# Altium project NCS_wireless_display.PrjPcb
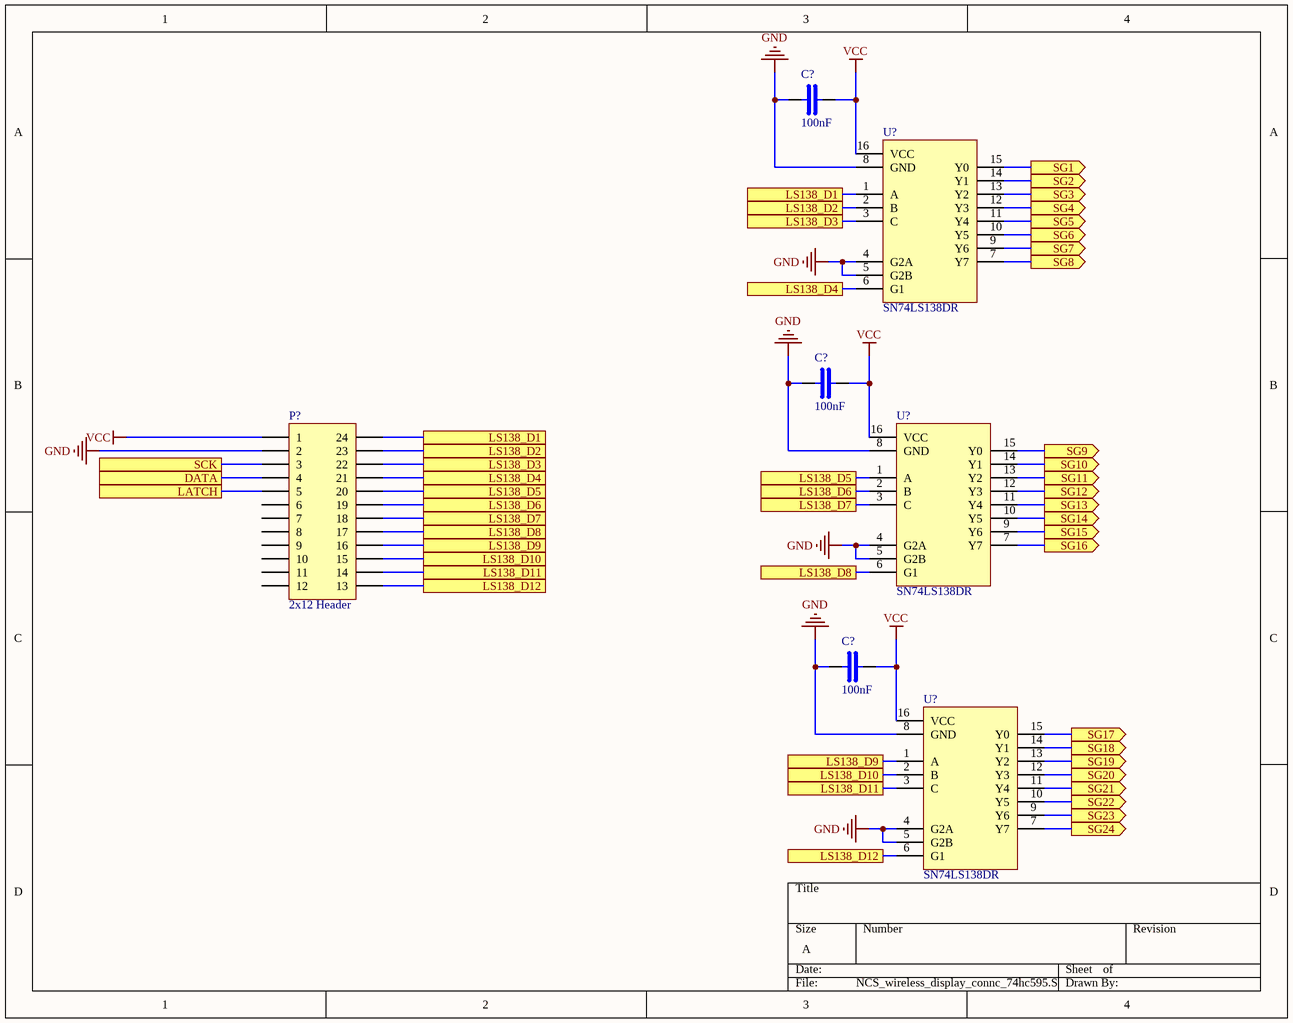
[diagram p0: NCS_wireless_display_connc_74hc595.SchDoc]
3 sheets, 18 parts. Net scope: flat (ports and power ports of the same name join across sheets).
Board file: NCS_wireless_display.PcbDoc
Sheets:
  NCS_wireless_display_connc_74hc595.SchDoc
  NCS_wireless_display_595.SchDoc
  NCS_wireless_display_raw1.SchDoc

## Sheet NCS_wireless_display_connc_74hc595.SchDoc
size A

### Parts
(Parts that share a designator on the sheet are numbered #1, #2 ... from top to bottom, then left to right.)
C?#1  100nF  [C0805C104K3RACTU_100nF]
C?#2  100nF  [C0805C104K3RACTU_100nF]
C?#3  100nF  [C0805C104K3RACTU_100nF]
P?  2x12 Header  [2x12 header]
U?#1  SN74LS138DR  [SN74LS138DR_SOIC16]
U?#2  SN74LS138DR  [SN74LS138DR_SOIC16]
U?#3  SN74LS138DR  [SN74LS138DR_SOIC16]

### Ports
DATA, LATCH, LS138_D1, LS138_D2, LS138_D3, LS138_D4, LS138_D5, LS138_D6, LS138_D7, LS138_D8, LS138_D9, LS138_D10, LS138_D11, LS138_D12, SCK, SG1 (out), SG2 (out), SG3 (out), SG4 (out), SG5 (out), SG6 (out), SG7 (out), SG8 (out), SG9 (out), SG10 (out), SG11 (out), SG12 (out), SG13 (out), SG14 (out), SG15 (out), SG16 (out), SG17 (out), SG18 (out), SG19 (out), SG20 (out), SG21 (out), SG22 (out), SG23 (out), SG24 (out)

### Nets
GND: C?#1.1 C?#2.1 C?#3.1 P?.2 U?#1.4(G2A) U?#1.5(G2B) U?#1.8(GND) U?#2.4(G2A) U?#2.5(G2B) U?#2.8(GND) U?#3.4(G2A) U?#3.5(G2B) U?#3.8(GND)
VCC: C?#1.2 C?#2.2 C?#3.2 P?.1 U?#1.16(VCC) U?#2.16(VCC) U?#3.16(VCC)
NetP?_3: P?.3 ; port SCK
NetP?_4: P?.4 ; port DATA
NetP?_5: P?.5 ; port LATCH
NetP?_13: P?.13 U?#3.6(G1) ; port LS138_D12
NetP?_14: P?.14 U?#3.3(C) ; port LS138_D11
NetP?_15: P?.15 U?#3.2(B) ; port LS138_D10
NetP?_16: P?.16 U?#3.1(A) ; port LS138_D9
NetP?_17: P?.17 U?#2.6(G1) ; port LS138_D8
NetP?_18: P?.18 U?#2.3(C) ; port LS138_D7
NetP?_19: P?.19 U?#2.2(B) ; port LS138_D6
NetP?_20: P?.20 U?#2.1(A) ; port LS138_D5
NetP?_21: P?.21 U?#1.6(G1) ; port LS138_D4
NetP?_22: P?.22 U?#1.3(C) ; port LS138_D3
NetP?_23: P?.23 U?#1.2(B) ; port LS138_D2
NetP?_24: P?.24 U?#1.1(A) ; port LS138_D1
NetR?_1: U?#1.15(Y0) ; port SG1
NetU?#1_7: U?#1.7(Y7) ; port SG8
NetU?#1_9: U?#1.9(Y6) ; port SG7
NetU?#1_10: U?#1.10(Y5) ; port SG6
NetU?#1_11: U?#1.11(Y4) ; port SG5
NetU?#1_12: U?#1.12(Y3) ; port SG4
NetU?#1_13: U?#1.13(Y2) ; port SG3
NetU?#1_14: U?#1.14(Y1) ; port SG2
NetU?#2_7: U?#2.7(Y7) ; port SG16
NetU?#2_9: U?#2.9(Y6) ; port SG15
NetU?#2_10: U?#2.10(Y5) ; port SG14
NetU?#2_11: U?#2.11(Y4) ; port SG13
NetU?#2_12: U?#2.12(Y3) ; port SG12
NetU?#2_13: U?#2.13(Y2) ; port SG11
NetU?#2_14: U?#2.14(Y1) ; port SG10
NetU?#2_15: U?#2.15(Y0) ; port SG9
NetU?#3_7: U?#3.7(Y7) ; port SG24
NetU?#3_9: U?#3.9(Y6) ; port SG23
NetU?#3_10: U?#3.10(Y5) ; port SG22
NetU?#3_11: U?#3.11(Y4) ; port SG21
NetU?#3_12: U?#3.12(Y3) ; port SG20
NetU?#3_13: U?#3.13(Y2) ; port SG19
NetU?#3_14: U?#3.14(Y1) ; port SG18
NetU?#3_15: U?#3.15(Y0) ; port SG17

Not connected (* = marked no-connect by the designer): P? 6 7 8 9 10 11 12

### Library data of the parts
C?#1-C?#3 = C0805C104K3RACTU: Multilayer Ceramic Capacitor, 0.1 uF, 25 V, ï¿½ 10%, X7R, 0805 [2012 Metric]; Manufacturer: KEMET; Material: 4241ConductorMaterial; Voltage Rating: 25V; Temperature Coefficient: 30ppm/°C; Supplier: Mouser; Supplier Part Number: 80-C0805C104K3R; Manufacturer Part Number: C0805C104K3RACTU; RoHS: Yes; Category: Ceramic Capacitors; Stock: 259681; Pricing: 1=0.1, 10=0.03, 50=0.03, 100=0.027, 1000=0.021, 10000=0.015 (USD); Mounting Technology: Surface Mount,PCB; Case/Package: 0805; Pins: 2NUMBER; Case Code (Imperial): 0805; Case Code (Metric): 2012; Min Operating Temperature: -55°C; Max Operating Temperature: 125°C; Packaging: Tape and Reel; Tolerance: 10%; Value: 100nF; Dielectric: X7R; Termination: SMD/SMT; Package Quantity: 4000; Series: SMD Comm X7R; Voltage Rating (DC): 25V; Construction: Flat; Length: 2mm; Width: 1.2mm; Height: 0.9mm; Depth: 1.25mm; Lead Pitch: 0.75mm; Thickness: 889um; Radiation Hardening: No; RoHS Compliant: Yes; Lead Free: 5697LeadFree; Reach SVHC Compliant: 4186SVHC; ComponentLink1URL: https://datasheet.ciiva.com/7842/kem-c1002-x7r-smd-7842536.pdf?src-supplier=Element14; ComponentLink1Description: https://datasheet.ciiva.com/7842/kem-c1002-x7r-smd-7842536.pdf?src-supplier=Element14; ComponentLink2URL: https://datasheet.ciiva.com/7842/kem-c1002-x7r-smd-7842538.pdf?src-supplier=Element14; ComponentLink2Description: https://datasheet.ciiva.com/7842/kem-c1002-x7r-smd-7842538.pdf?src-supplier=Element14
P? = 0702462401: 2.54mm Pitch C-Grid Header Low Profile Dual Row Vertical Shrouded 24 Circuits 0.38; Manufacturer: Molex; Supplier: Mouser; Supplier Part Number: 538-70246-2401; Manufacturer Part Number: 0702462401; RoHS: Yes; Stock: 1024; Pricing: 1=2.2, 10=1.67, 50=1.67, 100=1.31, 1000=1.31, 10000=1.29 (USD); ComponentLink1URL: https://datasheet.ciiva.com/9470/0702462401-pcb-headers-9470294.pdf?src-supplier=Avnet; ComponentLink1Description: https://datasheet.ciiva.com/9470/0702462401-pcb-headers-9470294.pdf?src-supplier=Avnet
U?#1-U?#3 = SN74LS138DR: 3-line to 8-line decoder / demultiplexer 16-SOIC 0 to 70; Manufacturer: Texas Instruments; Supplier: Mouser; Supplier Part Number: 595-SN74LS138DR; Manufacturer Part Number: SN74LS138DR; RoHS: Yes; Category: Logic ICs; Stock: 4138; Pricing: 1=0.53, 10=0.378, 50=0.378, 100=0.314, 1000=0.303, 10000=0.288 (USD); ComponentLink1URL: https://datasheet.ciiva.com/15092/getdatasheetpartid-251217-15092376.pdf?src-supplier=Verical; ComponentLink1Description: https://datasheet.ciiva.com/15092/getdatasheetpartid-251217-15092376.pdf?src-supplier=Verical; ComponentLink2URL: https://datasheet.ciiva.com/14293/sn54ls138-sp-14293534.pdf?src-supplier=Avnet; ComponentLink2Description: https://datasheet.ciiva.com/14293/sn54ls138-sp-14293534.pdf?src-supplier=Avnet

## Sheet NCS_wireless_display_595.SchDoc
size A
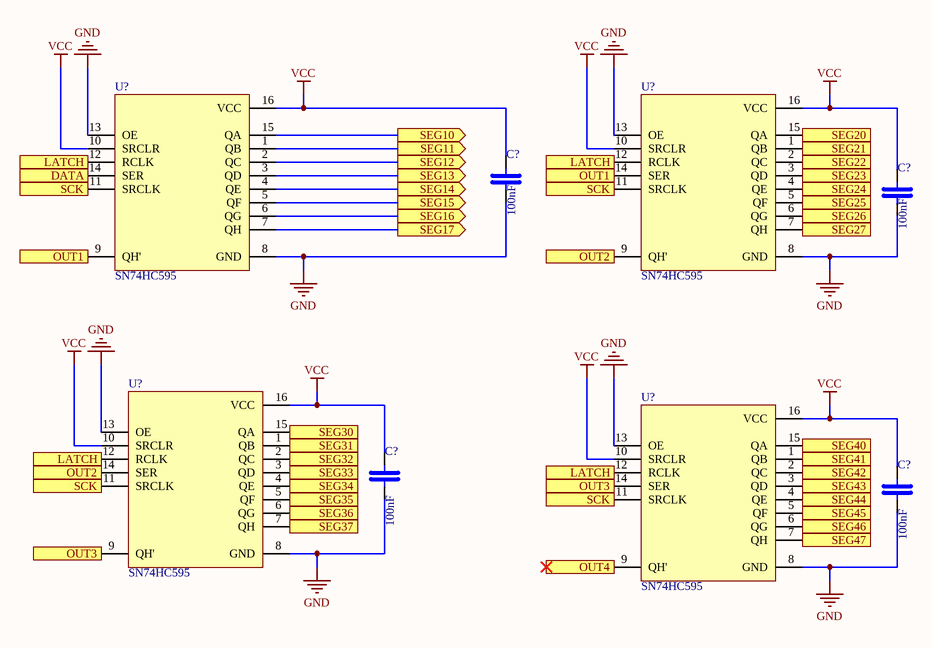
[diagram p1: NCS_wireless_display_595.SchDoc]

### Parts
(Parts that share a designator on the sheet are numbered #1, #2 ... from top to bottom, then left to right.)
C?#4  100nF  [C0805C104K3RACTU_100nF]
C?#5  100nF  [C0805C104K3RACTU_100nF]
C?#6  100nF  [C0805C104K3RACTU_100nF]
C?#7  100nF  [C0805C104K3RACTU_100nF]
U?#4  SN74HC595  [SN74HC595_SOIC16]
U?#5  SN74HC595  [SN74HC595_SOIC16]
U?#6  SN74HC595  [SN74HC595_SOIC16]
U?#7  SN74HC595  [SN74HC595_SOIC16]

### Ports
DATA (out), LATCH (out), OUT1 (out), OUT2 (out), OUT3 (out), OUT4 (out), SCK (out), SEG10 (out), SEG11 (out), SEG12 (out), SEG13 (out), SEG14 (out), SEG15 (out), SEG16 (out), SEG17 (out), SEG20 (out), SEG21 (out), SEG22 (out), SEG23 (out), SEG24 (out), SEG25 (out), SEG26 (out), SEG27 (out), SEG30 (out), SEG31 (out), SEG32 (out), SEG33 (out), SEG34 (out), SEG35 (out), SEG36 (out), SEG37 (out), SEG40 (out), SEG41 (out), SEG42 (out), SEG43 (out), SEG44 (out), SEG45 (out), SEG46 (out), SEG47 (out)

### Nets
GND: C?#4.1 C?#5.1 C?#6.1 C?#7.1 U?#4.8(GND) U?#4.13(OE) U?#5.8(GND) U?#5.13(OE) U?#6.8(GND) U?#6.13(OE) U?#7.8(GND) U?#7.13(OE)
VCC: C?#4.2 C?#5.2 C?#6.2 C?#7.2 U?#4.10(SRCLR) U?#4.16(VCC) U?#5.10(SRCLR) U?#5.16(VCC) U?#6.10(SRCLR) U?#6.16(VCC) U?#7.10(SRCLR) U?#7.16(VCC)
NetP?_3: U?#4.11(SRCLK) U?#5.11(SRCLK) U?#6.11(SRCLK) U?#7.11(SRCLK) ; port SCK
NetP?_4: U?#4.14(SER) ; port DATA
NetP?_5: U?#4.12(RCLK) U?#5.12(RCLK) U?#6.12(RCLK) U?#7.12(RCLK) ; port LATCH
NetU?#4_1: U?#4.1(QB) ; port SEG11
NetU?#4_2: U?#4.2(QC) ; port SEG12
NetU?#4_3: U?#4.3(QD) ; port SEG13
NetU?#4_4: U?#4.4(QE) ; port SEG14
NetU?#4_5: U?#4.5(QF) ; port SEG15
NetU?#4_6: U?#4.6(QG) ; port SEG16
NetU?#4_7: U?#4.7(QH) ; port SEG17
NetU?#4_9: U?#4.9(QH') U?#5.14(SER) ; port OUT1
NetU?#4_15: U?#4.15(QA) ; port SEG10
NetU?#5_1: U?#5.1(QB) ; port SEG21
NetU?#5_2: U?#5.2(QC) ; port SEG22
NetU?#5_3: U?#5.3(QD) ; port SEG23
NetU?#5_4: U?#5.4(QE) ; port SEG24
NetU?#5_5: U?#5.5(QF) ; port SEG25
NetU?#5_6: U?#5.6(QG) ; port SEG26
NetU?#5_7: U?#5.7(QH) ; port SEG27
NetU?#5_9: U?#5.9(QH') U?#6.14(SER) ; port OUT2
NetU?#5_15: U?#5.15(QA) ; port SEG20
NetU?#6_1: U?#6.1(QB) ; port SEG31
NetU?#6_2: U?#6.2(QC) ; port SEG32
NetU?#6_3: U?#6.3(QD) ; port SEG33
NetU?#6_4: U?#6.4(QE) ; port SEG34
NetU?#6_5: U?#6.5(QF) ; port SEG35
NetU?#6_6: U?#6.6(QG) ; port SEG36
NetU?#6_7: U?#6.7(QH) ; port SEG37
NetU?#6_9: U?#6.9(QH') U?#7.14(SER) ; port OUT3
NetU?#6_15: U?#6.15(QA) ; port SEG30
NetU?#7_1: U?#7.1(QB) ; port SEG41
NetU?#7_2: U?#7.2(QC) ; port SEG42
NetU?#7_3: U?#7.3(QD) ; port SEG43
NetU?#7_4: U?#7.4(QE) ; port SEG44
NetU?#7_5: U?#7.5(QF) ; port SEG45
NetU?#7_6: U?#7.6(QG) ; port SEG46
NetU?#7_7: U?#7.7(QH) ; port SEG47
NetU?#7_9: U?#7.9(QH') ; port OUT4
NetU?#7_15: U?#7.15(QA) ; port SEG40

### Library data of the parts
C?#4-C?#7 = C0805C104K3RACTU: as C?#1 on sheet NCS_wireless_display_connc_74hc595; Supplier: Mouser; Supplier Part Number: 80-C0805C104K3R; Manufacturer Part Number: C0805C104K3RACTU; RoHS: Yes; Category: Ceramic Capacitors; Stock: 259681; Pricing: 1=0.1, 10=0.03, 50=0.03, 100=0.027, 1000=0.021, 10000=0.015 (USD); Mounting Technology: Surface Mount,PCB; Case/Package: 0805; Pins: 2NUMBER; Case Code (Imperial): 0805; Case Code (Metric): 2012; Min Operating Temperature: -55°C; Max Operating Temperature: 125°C; Packaging: Tape and Reel; Tolerance: 10%; Value: 100nF; Dielectric: X7R; Termination: SMD/SMT; Package Quantity: 4000; Series: SMD Comm X7R; Voltage Rating (DC): 25V; Construction: Flat; Length: 2mm; Width: 1.2mm; Height: 0.9mm; Depth: 1.25mm; Lead Pitch: 0.75mm; Thickness: 889um; Radiation Hardening: No; RoHS Compliant: Yes; Lead Free: 5697LeadFree; Reach SVHC Compliant: 4186SVHC; ComponentLink1URL: https://datasheet.ciiva.com/7842/kem-c1002-x7r-smd-7842536.pdf?src-supplier=Element14; ComponentLink1Description: https://datasheet.ciiva.com/7842/kem-c1002-x7r-smd-7842536.pdf?src-supplier=Element14; ComponentLink2URL: https://datasheet.ciiva.com/7842/kem-c1002-x7r-smd-7842538.pdf?src-supplier=Element14; ComponentLink2Description: https://datasheet.ciiva.com/7842/kem-c1002-x7r-smd-7842538.pdf?src-supplier=Element14
U?#4-U?#7 = SN74HC595DR: HC/UH 74HC595 ROHS3Compliant Cut Tape (CT) shift register 34ns 1muA 141.690917mg 42MHz; Manufacturer: Texas Instruments; Supplier 1: Mouser; Manufacturer Part Number: SN74HC595DR; RoHS: Yes; Category: Shift Registers; Stock 1: 113533; Pricing 1: 1=0.26, 10=0.16, 50=0.16, 100=0.12, 1000=0.115, 10000=0.1 (USD); ComponentLink1URL: https://datasheet.ciiva.com/34301/916385-34301758.pdf?src-supplier=Jameco; ComponentLink1Description: https://datasheet.ciiva.com/34301/916385-34301758.pdf?src-supplier=Jameco; ComponentLink2URL: https://datasheet.ciiva.com/15093/getdatasheetpartid-134875-15093436.pdf?src-supplier=Verical; ComponentLink2Description: https://datasheet.ciiva.com/15093/getdatasheetpartid-134875-15093436.pdf?src-supplier=Verical; ComponentLink3URL: https://datasheet.ciiva.com/22696/1831198-22696812.pdf?src-supplier=Element14; ComponentLink3Description: https://datasheet.ciiva.com/22696/1831198-22696812.pdf?src-supplier=Element14; ComponentLink4URL: https://datasheet.ciiva.com/1886/sn74hc595-1886279.pdf?src-supplier=Digikey; ComponentLink4Description: https://datasheet.ciiva.com/1886/sn74hc595-1886279.pdf?src-supplier=Digikey; ComponentLink5URL: https://datasheet.ciiva.com/1886/sn74hc595-1886280.pdf?src-supplier=Digikey; ComponentLink5Description: https://datasheet.ciiva.com/1886/sn74hc595-1886280.pdf?src-supplier=Digikey; ComponentLink6URL: https://datasheet.ciiva.com/1886/sn74hc595-1886281.pdf?src-supplier=Digikey; ComponentLink6Description: https://datasheet.ciiva.com/1886/sn74hc595-1886281.pdf?src-supplier=Digikey; ComponentLink7URL: https://datasheet.ciiva.com/14294/sn74hc595-14294989.pdf?src-supplier=Avnet; ComponentLink7Description: https://datasheet.ciiva.com/14294/sn74hc595-14294989.pdf?src-supplier=Avnet; ComponentLink8URL: https://datasheet.ciiva.com/14294/sn74hc595-14294991.pdf?src-supplier=Avnet; ComponentLink8Description: https://datasheet.ciiva.com/14294/sn74hc595-14294991.pdf?src-supplier=Avnet; ComponentLink9URL: https://datasheet.ciiva.com/46435/1831198-46435871.pdf?src-supplier=Element14; ComponentLink9Description: https://datasheet.ciiva.com/46435/1831198-46435871.pdf?src-supplier=Element14; ComponentLink10URL: https://datasheet.ciiva.com/46381/1886142-46381835.pdf?src-supplier=Element14; ComponentLink10Description: https://datasheet.ciiva.com/46381/1886142-46381835.pdf?src-supplier=Element14; ComponentLink11URL: https://datasheet.ciiva.com/1509/1831198-1509483.pdf?src-supplier=Element14; ComponentLink11Description: https://datasheet.ciiva.com/1509/1831198-1509483.pdf?src-supplier=Element14; Supplier Part Number 1: 595-SN74HC595DR

## Sheet NCS_wireless_display_raw1.SchDoc
size A
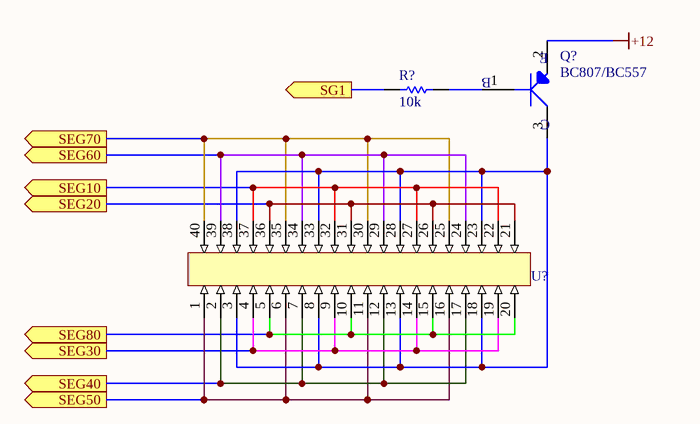
[diagram p2: NCS_wireless_display_raw1.SchDoc]

### Parts
(Parts that share a designator on the sheet are numbered #1, #2 ... from top to bottom, then left to right.)
Q?  BC807/BC557  [BC807/BC557_SOT23]
R?  10k  [RC0805FR-7W330RL]
U?#8  40 Pin IC Base  [DIP40]  (value not drawn)

### Ports
SEG10 (out), SEG20 (out), SEG30 (out), SEG40 (out), SEG50 (out), SEG60 (out), SEG70 (out), SEG80 (out), SG1 (out)

### Nets
+12: Q?.2(E)
NetQ?_1: Q?.1(B) R?.2
NetQ?_3: Q?.3(C) U?#8.3 U?#8.8 U?#8.13 U?#8.18 U?#8.23 U?#8.28 U?#8.33 U?#8.38
NetR?_1: R?.1 ; port SG1
NetU?#4_15: U?#8.22 U?#8.27 U?#8.32 U?#8.37 ; port SEG10
NetU?#5_15: U?#8.21 U?#8.26 U?#8.31 U?#8.36 ; port SEG20
NetU?#6_15: U?#8.4 U?#8.9 U?#8.14 U?#8.19 ; port SEG30
NetU?#7_15: U?#8.2 U?#8.7 U?#8.12 U?#8.17 ; port SEG40
NetU?#8_1: U?#8.1 U?#8.6 U?#8.11 U?#8.16 ; port SEG50
NetU?#8_5: U?#8.5 U?#8.10 U?#8.15 U?#8.20 ; port SEG80
NetU?#8_24: U?#8.24 U?#8.29 U?#8.34 U?#8.39 ; port SEG60
NetU?#8_25: U?#8.25 U?#8.30 U?#8.35 U?#8.40 ; port SEG70

### Library data of the parts
Q? = BC807-25LT1G: Trans GP BJT PNP 45V 0.5A 3-Pin SOT-23 T/R - Product that comes on tape, but is not reeled; Manufacturer: ON Semiconductor; Supplier 1: Arrow Electronics; Manufacturer Part Number: BC807-25LT1G; RoHS: Yes; Category: BJTs; Stock 1: 2607000; Pricing 1: 3000=0.0196, 9000=0.0143 (USD); ComponentLink1URL: https://datasheet.ciiva.com/15138/getdatasheetpartid-32011-15138578.pdf?src-supplier=Verical; ComponentLink1Description: https://datasheet.ciiva.com/15138/getdatasheetpartid-32011-15138578.pdf?src-supplier=Verical; ComponentLink2URL: https://datasheet.ciiva.com/4722/bc807-16lt1-d-106678-4722830.pdf?src-supplier=Mouser; ComponentLink2Description: https://datasheet.ciiva.com/4722/bc807-16lt1-d-106678-4722830.pdf?src-supplier=Mouser; ComponentLink3URL: https://datasheet.ciiva.com/7972/bc807-16lt1-d-7972185.pdf?src-supplier=Element14; ComponentLink3Description: https://datasheet.ciiva.com/7972/bc807-16lt1-d-7972185.pdf?src-supplier=Element14; ComponentLink4URL: https://datasheet.ciiva.com/11197/bc807-16lt1-d-11197499.pdf?src-supplier=Avnet; ComponentLink4Description: https://datasheet.ciiva.com/11197/bc807-16lt1-d-11197499.pdf?src-supplier=Avnet; ComponentLink5URL: https://datasheet.ciiva.com/11197/bc807-16lt1-d-11197830.pdf?src-supplier=Avnet; ComponentLink5Description: https://datasheet.ciiva.com/11197/bc807-16lt1-d-11197830.pdf?src-supplier=Avnet; ComponentLink6URL: https://datasheet.ciiva.com/5720/bc807-16lt1-d-5720171.pdf?src-supplier=Farnell; ComponentLink6Description: https://datasheet.ciiva.com/5720/bc807-16lt1-d-5720171.pdf?src-supplier=Farnell; ComponentLink7URL: https://datasheet.ciiva.com/976/bc807-16lt1-d-976425.pdf?src-supplier=Digikey; ComponentLink7Description: https://datasheet.ciiva.com/976/bc807-16lt1-d-976425.pdf?src-supplier=Digikey; ComponentLink8URL: https://datasheet.ciiva.com/976/bc807-16lt1-d-976426.pdf?src-supplier=Digikey; ComponentLink8Description: https://datasheet.ciiva.com/976/bc807-16lt1-d-976426.pdf?src-supplier=Digikey; ComponentLink9URL: https://datasheet.ciiva.com/976/bc807-16lt1-d-976427.pdf?src-supplier=Digikey; ComponentLink9Description: https://datasheet.ciiva.com/976/bc807-16lt1-d-976427.pdf?src-supplier=Digikey; ComponentLink10URL: https://datasheet.ciiva.com/16205/bc807-16lt1-d-16205062.pdf?src-supplier=Future+Electronics; ComponentLink10Description: https://datasheet.ciiva.com/16205/bc807-16lt1-d-16205062.pdf?src-supplier=Future+Electronics; Supplier Part Number 1: BC807-25LT1G
R? = RC0805FR-7W330RL: Res Thick Film 0805 330 Ohm 1% 0.25W(1/4W) ±200ppm/C Pad SMD T/R; Manufacturer: Yageo; Value: 330R; Supplier: Digikey; Supplier Part Number: 13-RC0805FR-7W330RLCT-ND; Manufacturer Part Number: RC0805FR-7W330RL; RoHS: Yes; Category: Chip SMD Resistors; Stock: 5595; Pricing: 1=0.17, 10=0.057, 50=0.046, 100=0.0347, 500=0.03264, 1000=0.0306 (USD); Case/Package: 339Case; Packaging: 10Packaging

## Nets that join several sheets
GND: NCS_wireless_display_connc_74hc595 (13 pins), NCS_wireless_display_595 (12 pins)
VCC: NCS_wireless_display_connc_74hc595 (7 pins), NCS_wireless_display_595 (12 pins)
NetP?_3: NCS_wireless_display_connc_74hc595 (P?.3), NCS_wireless_display_595 (U?#4.11 U?#5.11 U?#6.11 U?#7.11)
NetP?_4: NCS_wireless_display_connc_74hc595 (P?.4), NCS_wireless_display_595 (U?#4.14)
NetP?_5: NCS_wireless_display_connc_74hc595 (P?.5), NCS_wireless_display_595 (U?#4.12 U?#5.12 U?#6.12 U?#7.12)
NetR?_1: NCS_wireless_display_connc_74hc595 (U?#1.15), NCS_wireless_display_raw1 (R?.1)
NetU?#4_15: NCS_wireless_display_595 (U?#4.15), NCS_wireless_display_raw1 (U?#8.22 U?#8.27 U?#8.32 U?#8.37)
NetU?#5_15: NCS_wireless_display_595 (U?#5.15), NCS_wireless_display_raw1 (U?#8.21 U?#8.26 U?#8.31 U?#8.36)
NetU?#6_15: NCS_wireless_display_595 (U?#6.15), NCS_wireless_display_raw1 (U?#8.4 U?#8.9 U?#8.14 U?#8.19)
NetU?#7_15: NCS_wireless_display_595 (U?#7.15), NCS_wireless_display_raw1 (U?#8.2 U?#8.7 U?#8.12 U?#8.17)